# EAGLE design ADSB_Filter+LNA (EAGLE 6.2)
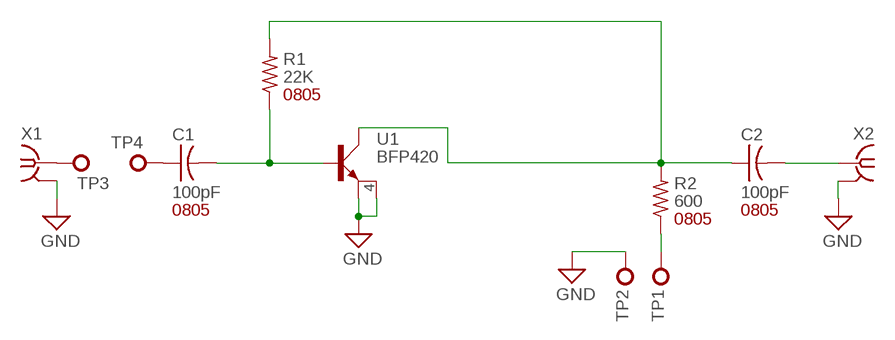
[diagram p0: schematic, sheet 1]

## Parts
C1  100pF  CAP0805  [0805]
C2  100pF  CAP0805  [0805]
R1  22K  RES0805  [0805]
R2  600  RES0805  [0805]
TP1  TEST_POINTS76_150  [SMD_76_150]
TP2  TEST_POINTS76_150  [SMD_76_150]
TP3  TEST_POINTS8_8  [SMD_8_8]
TP4  TEST_POINTS8_8  [SMD_8_8]
U1  BFP420  [SOT343_INFINEON]
X1  SMA-142-0701-801/806  [J502-ND-142-0701-801/806]
X2  SMA-142-0701-801/806  [J502-ND-142-0701-801/806]

## Nets
1: TP3.1(MP) X1.1
10: C1.1 TP4.1(MP)
GND: TP2.1(MP) U1.2(E1) U1.4(E2) X1.G@1(GND) X2.G@1(GND)
N$2: C1.2 R1.1 U1.1(B)
N$4: C2.1 R1.2 R2.2 U1.3(C)
N$5: R2.1 TP1.1(MP)
N$6: C2.2 X2.1

## Notes on the sheet
- 0805
- 0805 | 0805
- 0805

## Power pins joined to a net without a drawn wire
GND: X1.G@2(GND) X1.G@3(GND) X1.G@4(GND) X2.G@2(GND) X2.G@3(GND) X2.G@4(GND)

## Library data of the parts
C1 C2 = Passives:CAP: Capacitor, Capacitor
R1 R2 = Passives:RES: Resistor, Resistor
TP1-TP4 = Pads_Test_Points:TEST_POINT: Test Point
U1 = transistor-small-signal:BFP420
X1 X2 = con-coax:SMA-: SMA 50 Ohm End Launch Jack Receptacle - Round Contact Johnson Components Source: www.johnsoncomponents.com .. J502-ND.pdf; MF: JOHNSON COMPONENTS; MPN: 142-0701-801; OC_FARNELL: 1608592; OC_NEWARK: 90F2624

## Board
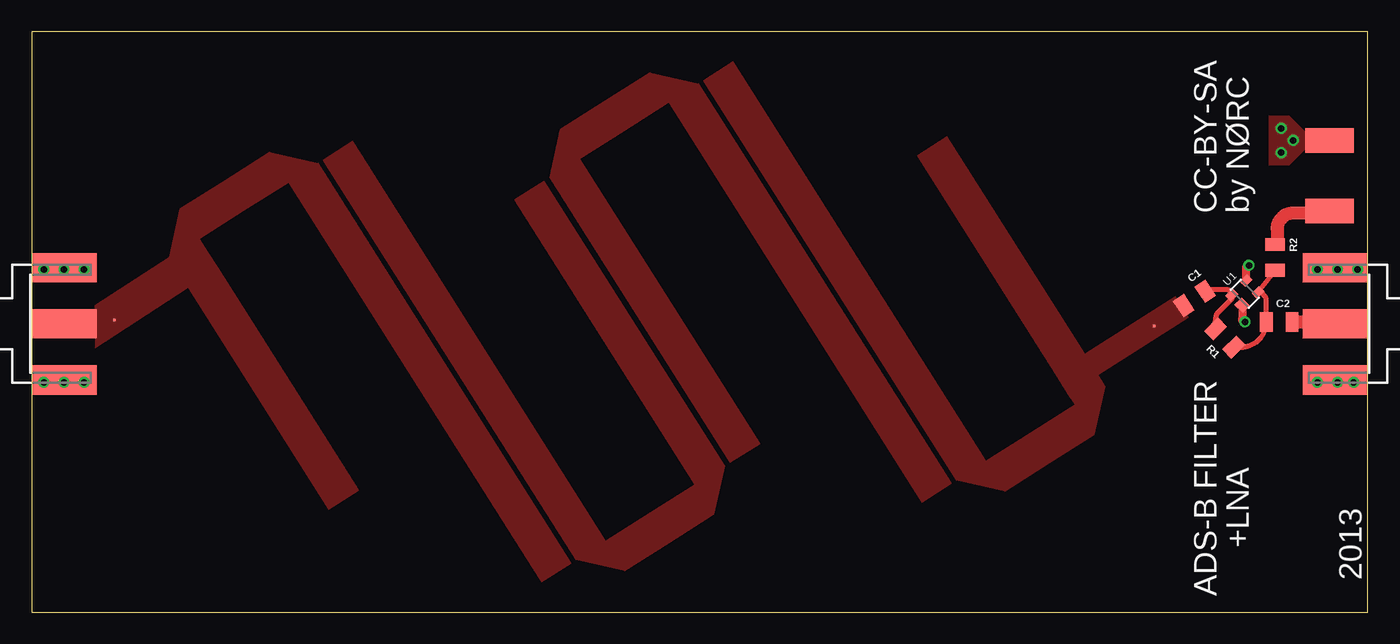
[diagram p1: board, top side]
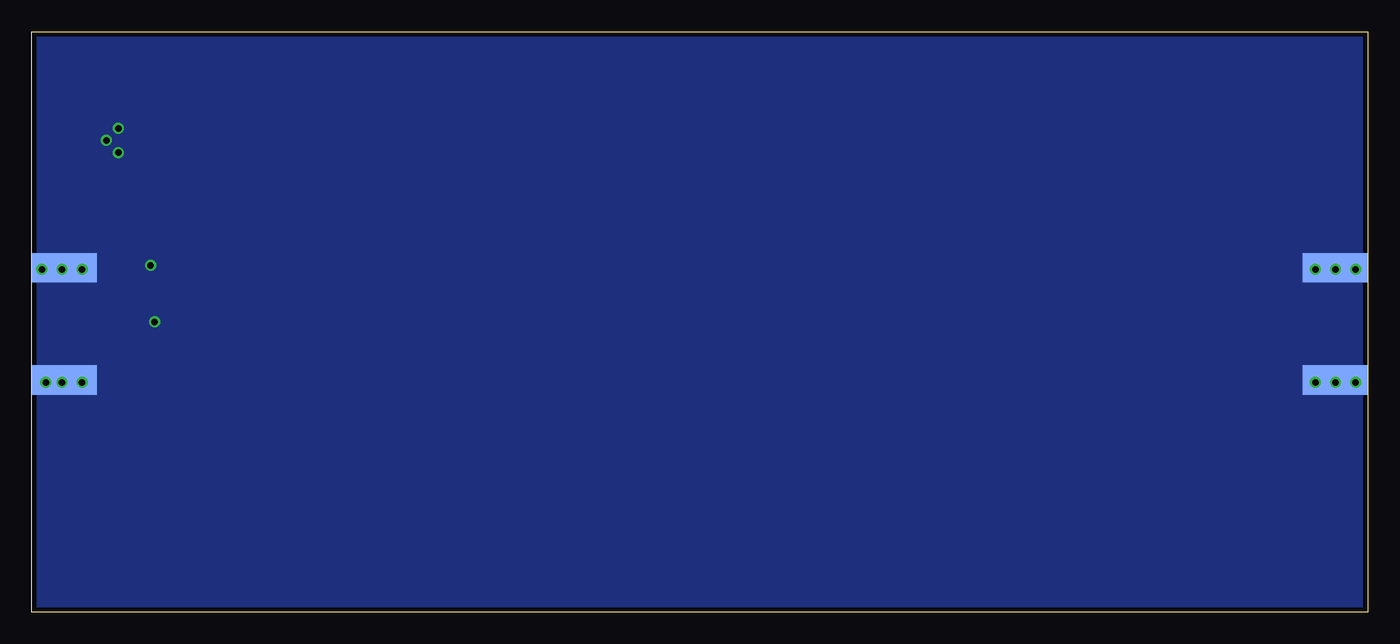
[diagram p2: board, bottom side, seen from below]

Size 105.25 x 45.71 mm. Coordinates in mm from the lower left corner, seen from the top.
Outline: 0,0 105.25,0 105.25,45.71 0,45.71 0,0
Copper layers (1*16): Top 0.0356mm / dielectric 1.5011mm / Bottom 0.0356mm
Design rules: minimum track width 6mil, minimum drill 13mil, track to track 6mil, track to pad 6mil, pad to pad 6mil, via to via 6mil, smd to smd 6mil, copper to edge 15mil, drill to drill 6mil, minimum pad ring 7mil, minimum via ring 7mil, stop-mask expansion 4mil, vias tented up to drill 0mil, thermal gap 10mil

### Footprints (pad centres in the part's own frame; a part is rotated, then mirrored left to right if it is on the bottom)
0805 = smd 1.016 x 1.524: 1 -1.016,0; 2 1.016,0
SMD_76_150 = smd 1.93 x 3.81: 1 0,0
SMD_8_8 = smd 0.203 x 0.203: 1 0,0
SOT343_INFINEON = smd 0.6 x 0.8: 1 -0.65,-0.8; 3 0.65,0.8; 4 -0.65,0.8 | smd 0.9 x 0.8: 2 0.5,-0.8
J502-ND-142-0701-801/806 = smd 5.08 x 2.286: 1 2.565,0; G@1 2.565,4.42; G@2 2.565,-4.42 | smd 5.08 x 2.286 bottom: G@3 2.565,4.42; G@4 2.565,-4.42

### Placement (x,y rotation side)
C1  91.59,24.71 33.7 top
C2  98.27,22.86 0 top
R1  93.98,21.59 315 top
R2  97.95,27.94 270 top
TP1  102.23,31.59 90 top
TP2  102.23,37.15 270 top
TP3  6.51,23.02 0 top
TP4  88.42,22.54 0 top
U1  95.57,25.08 315 top
X1  0,22.7 0 top
X2  105.25,22.7 180 top

### Tracks (layer width: path | path; a pad name or v marks a point on that pad's centre or on a via)
1
  pour Top (no thermals): 10.85,27.93 4.94,24.12 5,20.82 12.34,25.59
2
  pour Top: 15.23,33.98 11.71,31.76 13.2,29.41 16.71,31.64
3
  pour Top: 18.74,36.2 15.23,33.98 16.71,31.64 20.22,33.86
4
  pour Top: 48.73,7.82 45.22,5.59 46.7,3.25 50.21,5.47
5
  pour Top: 52.24,10.04 48.73,7.82 50.21,5.47 53.72,7.7
6
  pour Top: 45.19,40.26 41.67,38.03 43.16,35.69 46.67,37.92
7
  pour Top: 48.7,42.48 45.19,40.26 46.67,37.92 50.18,40.14
8
  pour Top: 78.69,14.09 75.18,11.87 76.66,9.53 80.17,11.75
9
  pour Top: 82.2,16.32 78.69,14.09 80.17,11.75 83.68,13.98
10
  pour Top (no thermals): 90.08,24.84 82.94,20.32 83.98,18.69 91.12,23.21
11
  pour Top: 13.94,28.24 13.2,29.41 10.85,27.93 11.6,26.76
12
  pour Top: 14.68,27.07 13.94,28.24 11.6,26.76 12.34,25.59
13
  pour Top: 10.85,27.93 11.71,31.76 13.2,29.41
14
  pour Top: 18.74,36.2 22.56,35.35 20.22,33.86
15
  pour Top: 46.7,3.25 42.87,4.11 45.22,5.59
16
  pour Top: 54.57,11.51 53.72,7.7 52.24,10.03
17
  pour Top: 40.82,34.22 41.68,38.03 43.15,35.7
18
  pour Top: 48.7,42.48 52.52,41.62 50.18,40.14
19
  pour Top: 76.66,9.53 72.83,10.39 75.18,11.87
20
  pour Top: 84.54,17.8 83.68,13.98 82.2,16.32
21
  pour Top: 81.12,18.02 81.64,17.21 83.98,18.69 83.46,19.51
22
  pour Top: 80.6,18.84 81.12,18.02 83.46,19.51 82.94,20.32
23
  pour Top: 20.23,33.87 40.16,2.39 42.49,3.87 22.56,35.34
24
  pour Top: 22.95,35.59 42.88,4.11 45.21,5.59 25.28,37.07
25
  pour Top: 50.19,40.14 70.12,8.67 72.45,10.14 52.52,41.62
26
  pour Top: 52.91,41.87 72.84,10.39 75.17,11.87 55.24,43.34
27
  pour Top: 38.04,32.46 52.24,10.03 54.57,11.51 40.37,33.94
28
  pour Top: 40.82,34.22 55.02,11.8 57.36,13.27 43.15,35.7
29
  pour Top: 81.64,17.21 82.2,16.32 84.54,17.8 83.98,18.69
30
  pour Top: 69.76,35.96 80.6,18.84 82.94,20.32 72.11,37.44
31
  pour Top: 12.34,25.59 23.41,8.11 25.75,9.6 14.68,27.07
GND  (via drill 0.51 pad 0.76)
  Top 0.635: U1.4 95.67,27.09 arc-90 v95.88,27.3 | U1.2 95.35,23.07 arc90 v95.57,22.86 | X2.G@1 101.47,18.28 arc90 v101.28,18.1 v104.14,18.1 | X2.G@4 101.42,27.12 arc90 v101.28,26.99 v104.46,26.99 102.82,26.99 arc-90 X2.G@4 | X1.G@4 1.14,18.28 arc90 v0.95,18.1 1.27,18.1 2.38,18.1 arc90 X1.G@4 | X1.G@1 1.09,27.12 arc90 v0.95,26.99 2.43,26.99 arc90 X1.G@1
  other vias: 99.38,37.15 98.42,38.1 98.42,36.2 102.87,26.99 102.87,18.1 2.54,26.99 4.13,26.99 2.54,18.1 4.13,18.1
  pour Bottom (no thermals): 0,0 105.25,0 105.25,45.72 0,45.72
  pour Top (no thermals): 100.65,37.78 100.33,37.78 99.06,39.05 97.47,39.05 97.47,35.24 99.06,35.24 100.33,36.51 100.65,36.51
N$2
  Top 0.381: C1.2 arc-90 92.57,25.4 93.34,25.4 94.12,25.4 arc-90 U1.1 94.54,24.69 93.34,23.5 arc28 R1.1
N$4
  Top 0.381: R1.2 95.26,20.87 arc90 C2.1 97.25,24.53 arc90 U1.3 R2.2
N$5
  Top 1.016: TP1.1 arc-90 102.08,31.43 100.01,31.43 99.38,31.43 arc90 98.11,30.16 98.11,29.12 arc-90 R2.1
N$6
  Top 1.016: C2.2 102.53,22.86 arc-90 X2.1

### Text on the board
tNames: CC-BY-SA | by NØRC | +LNA | 2013 | ADS-B FILTER